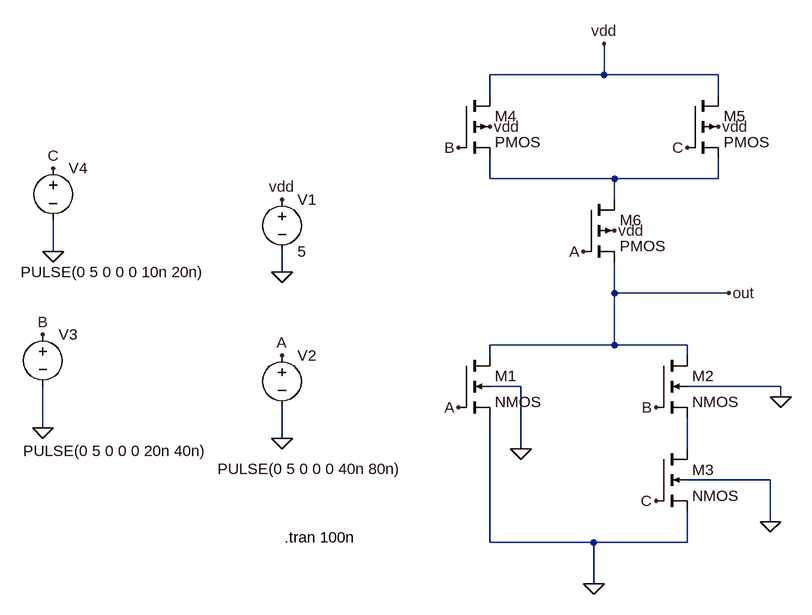
[diagram p0: schematic static_cmos_1.asc]
static_cmos_1.asc, the LTspice schematic file:
Version 4
SHEET 1 880 736
WIRE 288 -336 288 -384
WIRE 288 -336 112 -336
WIRE 464 -336 288 -336
WIRE 112 -304 112 -336
WIRE 464 -304 464 -336
WIRE 112 -176 112 -208
WIRE 304 -176 112 -176
WIRE 464 -176 464 -208
WIRE 464 -176 304 -176
WIRE 304 -144 304 -176
WIRE -560 -64 -560 -112
WIRE -208 -32 -208 -64
WIRE 304 0 304 -48
WIRE 480 0 304 0
WIRE 304 80 304 0
WIRE 304 80 112 80
WIRE 416 80 304 80
WIRE 112 96 112 80
WIRE 416 96 416 80
WIRE 160 144 112 144
WIRE 560 144 416 144
WIRE 560 160 560 144
WIRE -576 208 -576 144
WIRE -208 224 -208 176
WIRE 160 240 160 144
WIRE 416 240 416 192
WIRE 544 288 416 288
WIRE 544 352 544 288
WIRE 112 384 112 192
WIRE 272 384 112 384
WIRE 416 384 416 336
WIRE 416 384 272 384
WIRE 272 448 272 384
FLAG -208 -144 vdd
FLAG 272 448 0
FLAG 160 240 0
FLAG 560 160 0
FLAG 544 352 0
FLAG -576 208 0
FLAG -208 224 0
FLAG -208 -32 0
FLAG 288 -384 vdd
FLAG 112 -256 vdd
FLAG 464 -256 vdd
FLAG 304 -96 vdd
FLAG -560 -64 0
FLAG -208 96 A
FLAG 64 176 A
FLAG 256 -64 A
FLAG -576 64 B
FLAG 368 176 B
FLAG 64 -224 B
FLAG -560 -192 C
FLAG 368 320 C
FLAG 416 -224 C
FLAG 480 0 out
SYMBOL voltage -208 -160 R0
WINDOW 123 0 0 Left 0
WINDOW 39 0 0 Left 0
SYMATTR InstName V1
SYMATTR Value 5
SYMBOL voltage -208 80 R0
WINDOW 3 -99 191 Left 2
WINDOW 123 0 0 Left 0
WINDOW 39 0 0 Left 0
SYMATTR InstName V2
SYMATTR Value PULSE(0 5 0 0 0 40n 80n)
SYMBOL voltage -576 48 R0
WINDOW 3 -30 195 Left 2
WINDOW 123 0 0 Left 0
WINDOW 39 0 0 Left 0
SYMATTR InstName V3
SYMATTR Value PULSE(0 5 0 0 0 20n 40n)
SYMBOL nmos4 64 96 R0
SYMATTR InstName M1
SYMBOL nmos4 368 96 R0
SYMATTR InstName M2
SYMBOL nmos4 368 240 R0
SYMATTR InstName M3
SYMBOL pmos4 64 -304 R0
SYMATTR InstName M4
SYMBOL pmos4 416 -304 R0
SYMATTR InstName M5
SYMBOL pmos4 256 -144 R0
SYMATTR InstName M6
SYMBOL voltage -560 -208 R0
WINDOW 3 -50 176 Left 2
WINDOW 123 0 0 Left 0
WINDOW 39 0 0 Left 0
SYMATTR InstName V4
SYMATTR Value PULSE(0 5 0 0 0 10n 20n)
TEXT -204 376 Left 2 !.tran 100n

The netlist it stands for:
* static_cmos_1.asc
V1 vdd 0 5
V2 A 0 PULSE(0 5 0 0 0 40n 80n)
V3 B 0 PULSE(0 5 0 0 0 20n 40n)
M1 out A 0 0 NMOS
M2 out B N002 0 NMOS
M3 N002 C 0 0 NMOS
M4 vdd B N001 vdd PMOS
M5 vdd C N001 vdd PMOS
M6 N001 A out vdd PMOS
V4 C 0 PULSE(0 5 0 0 0 10n 20n)
.model NMOS NMOS
.model PMOS PMOS
.lib standard.mos
.tran 100n
.backanno
.end